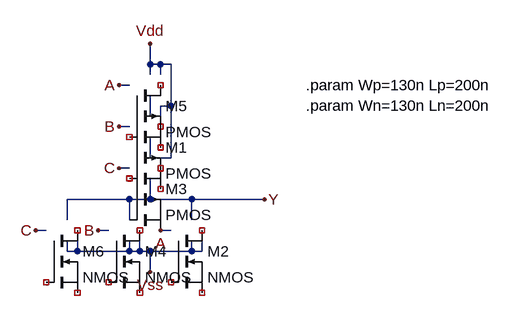
[diagram p0: schematic nor3.asc]
nor3.asc, the LTspice schematic file:
Version 4
SHEET 1 880 680
WIRE -160 -272 -160 -304
WIRE -144 -272 -160 -272
WIRE -128 -272 -144 -272
WIRE -160 -256 -160 -272
WIRE -144 -256 -144 -272
WIRE -192 -240 -208 -240
WIRE -128 -208 -128 -272
WIRE -128 -208 -144 -208
WIRE -160 -192 -160 -224
WIRE -144 -192 -144 -208
WIRE -192 -176 -208 -176
WIRE -160 -128 -160 -160
WIRE -128 -128 -128 -208
WIRE -128 -128 -144 -128
WIRE -192 -112 -208 -112
WIRE -192 -64 -288 -64
WIRE -160 -64 -160 -96
WIRE -160 -64 -192 -64
WIRE -96 -64 -160 -64
WIRE 16 -64 -96 -64
WIRE -288 -32 -288 -64
WIRE -192 -32 -192 -64
WIRE -96 -32 -96 -64
WIRE -320 -16 -336 -16
WIRE -224 -16 -240 -16
WIRE -128 -16 -144 -16
WIRE -288 16 -288 0
WIRE -272 16 -272 0
WIRE -272 16 -288 16
WIRE -192 16 -192 0
WIRE -192 16 -272 16
WIRE -176 16 -176 0
WIRE -176 16 -192 16
WIRE -160 16 -176 16
WIRE -96 16 -96 0
WIRE -96 16 -160 16
WIRE -80 16 -80 0
WIRE -80 16 -96 16
WIRE -160 48 -160 16
FLAG 16 -64 Y
FLAG -208 -176 B
FLAG -160 48 Vss
FLAG -160 -304 Vdd
FLAG -240 -16 B
FLAG -144 -16 A
FLAG -208 -112 C
FLAG -208 -240 A
FLAG -336 -16 C
SYMBOL pmos -192 -176 R0
SYMATTR InstName M1
SYMATTR SpiceLine W={Wp} L={Lp}
SYMBOL nmos -128 -16 R0
SYMATTR InstName M2
SYMATTR SpiceLine W={Wn} L={Ln}
SYMBOL pmos -192 -112 R0
SYMATTR InstName M3
SYMATTR SpiceLine W={Wp} L={Lp}
SYMBOL nmos -224 -16 R0
SYMATTR InstName M4
SYMATTR SpiceLine W={Wn} L={Ln}
SYMBOL pmos -192 -240 R0
SYMATTR InstName M5
SYMATTR SpiceLine W={Wp} L={Lp}
SYMBOL nmos -320 -16 R0
SYMATTR InstName M6
SYMATTR SpiceLine W={Wn} L={Ln}
TEXT 80 -240 Left 2 !.param Wp=130n Lp=200n\n.param Wn=130n Ln=200n

The netlist it stands for:
* nor3.asc
* M1: PMOS W={Wp} L={Lp} (symbol pmos not certain, pin order unknown); nets seen at it: 
* M2: NMOS W={Wn} L={Ln} (symbol nmos not certain, pin order unknown); nets seen at it: 
* M3: PMOS W={Wp} L={Lp} (symbol pmos not certain, pin order unknown); nets seen at it: A, Y
* M4: NMOS W={Wn} L={Ln} (symbol nmos not certain, pin order unknown); nets seen at it: 
* M5: PMOS W={Wp} L={Lp} (symbol pmos not certain, pin order unknown); nets seen at it: 
* M6: NMOS W={Wn} L={Ln} (symbol nmos not certain, pin order unknown); nets seen at it: 
.param Wp=130n Lp=200n
.param Wn=130n Ln=200n
.backanno
.end